# EAGLE design morseovka (EAGLE 9.1.3)
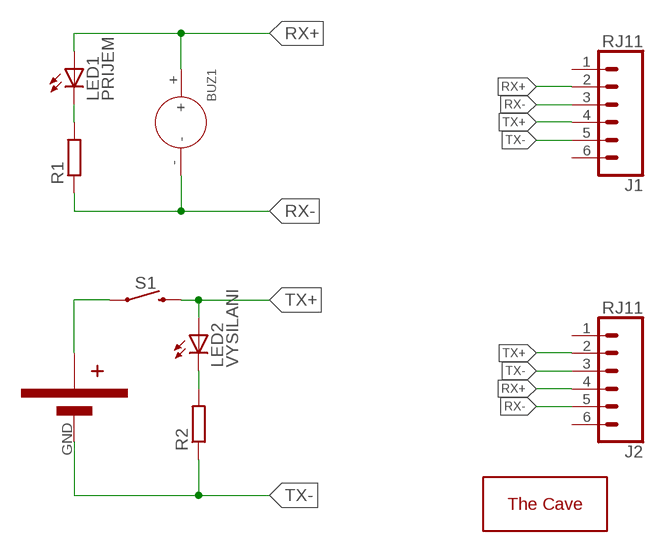
[diagram p0: schematic, sheet 1]

## Parts
BUZ1  DIP-BUZZER-3V(KS-12065D03YA)  [BZ2-7.6-D12.0XH6.5MM]
J1  RJ11  RJ11-6  [RJ11-6]
J2  RJ11  RJ11-6  [RJ11-6]
LED1  PRIJEM  LED5MM  [LED5MM]
LED2  VYSILANI  LED5MM  [LED5MM]
R1  R-EU_0207/7  [0207/7]
R2  R-EU_0207/7  [0207/7]
S1  MOMENTARY-SWITCH-SPST-PTH-12MM  [TACTILE_SWITCH_PTH_12MM]
U$1  CR2032HSMD  [CR2032H]
U$2  THECAVE_LOGO_NEW_TOP  [NEW_LOGO_TOP]

## Nets
N$1: LED1.K(C) R1.2
N$2: S1.1 U$1.VCC.1(VCC) U$1.VCC.2(VCC)
N$4: LED2.K(C) R2.2
RX+: BUZ1.+ J1.2 J2.4 LED1.A
RX-: BUZ1.- J1.3 J2.5 R1.1
TX+: J1.4 J2.2 LED2.A S1.3
TX-: J1.5 J2.3 R2.1 U$1.GND
Unconnected: J1.1 J1.6 J2.1 J2.6

## Library data of the parts
BUZ1 = Seeed-Connector:DIP-BUZZER-3V(KS-12065D03YA): 312010004; MPN: KS-12065D03YA; VALUE: KS-12065D03YA
J1 J2 = SparkFun-Connectors:RJ11-6: RJ11 Jack - 6 pin Commonly found on CAT3 devices and some Microchip programmers. Here is the connector we sell at SparkFun: RJ11 6-Pin Connector <https://www.sparkfun.com/products/132> (PRT-00132) Datasheet <http://www.sparkfun.com/datasheets/Prototyping/Connectors/RJ11-Datasheet.pdf> It is used on this SparkFun product: SparkFun Weather Shield <https://www.sparkfun.com/products/12081> (DEV-12081) Weather Meters <https://www.sparkfun.com/products/8942> (SEN-08942); PROD_ID: CONN-08590; SF_ID: PRT-00132
LED1 LED2 = led:LED: LED OSRAM: - CHIPLED LG R971, LG N971, LY N971, LG Q971, LY Q971, LO R971, LY R971 LH N974, LH R974 LS Q976, LO Q976, LY Q976 LO Q996 - Hyper CHIPLED LW Q18S LB Q993, LB Q99A, LB R99A - SideLED LS A670, LO A670, LY A670, LG A670, LP A670 LB A673, LV A673, LT A673, LW A673 LH A674 LY A675 LS A676, LA A676, LO A676, LY A676, LW A676 LS A679, LY A679, LG A679 - Hyper Micro SIDELED® LS Y876, LA Y876, LO Y876, LY Y876 LT Y87S - SmartLED LW L88C, LW L88S LB L89C, LB L89S, LG L890 LS L89K, LO L89K, LY L89K LS L896, LA L896, LO L896, LY L896 - TOPLED LS T670, LO T670, LY T670, LG T670, LP T670 LSG T670, LSP T670, LSY T670, LOP T670, LYG T670 LG T671, LOG T671, LSG T671 LB T673, LV T673, LT T673, LW T673 LH T674 LS T676, LA T676, LO T676, LY T676, LB T676, LH T676, LSB T676, LW T676 LB T67C, LV T67C, LT T67C, LS T67K, LO T67K, LY T67K, LW E67C LS E67B, LA E67B, LO E67B, LY E67B, LB E67C, LV E67C, LT E67C LW T67C LS T679, LY T679, LG T679 LS T770, LO T770, LY T770, LG T770, LP T770 LB T773, LV T773, LT T773, LW T773 LH T774 LS E675, LA E675, LY E675, LS T675 LS T776, LA T776, LO T776, LY T776, LB T776 LHGB T686 LT T68C, LB T68C - Hyper Mini TOPLED® LB M676 - Mini TOPLED Santana® LG M470 LS M47K, LO M47K, LY M47K Source: http://www.osram.convergy.de LUXEON: - LUMILED® LXK2-PW12-R00, LXK2-PW12-S00, LXK2-PW14-U00, LXK2-PW14-V00 LXK2-PM12-R00, LXK2-PM12-S00, LXK2-PM14-U00 LXK2-PE12-Q00, LXK2-PE12-R00, LXK2-PE12-S00, LXK2-PE14-T00, LXK2-PE14-U00 LXK2-PB12-K00, LXK2-PB12-L00, LXK2-PB12-M00, LXK2-PB14-N00, LXK2-PB14-P00, LXK2-PB14-Q00 LXK2-PR12-L00, LXK2-PR12-M00, LXK2-PR14-Q00, LXK2-PR14-R00 LXK2-PD12-Q00, LXK2-PD12-R00, LXK2-PD12-S00 LXK2-PH12-R00, LXK2-PH12-S00 LXK2-PL12-P00, LXK2-PL12-Q00, LXK2-PL12-R00 Source: www.luxeon.com KINGBRIGHT: KA-3528ASYC Source: www.kingbright.com
R1 R2 = rcl:R-EU_: RESISTOR, European symbol
S1 = SparkFun-Switches:MOMENTARY-SWITCH-SPST: Momentary Switch (Pushbutton) - SPST Normally-open (NO) SPST momentary switches (buttons, pushbuttons). Variants PTH-12MM - 12mm square, through-hole Momentary Pushbutton Switch - 12mm Square <https://www.sparkfun.com/products/9190> (COM-09190) PTH-6.0MM, PTH-6.0MM-KIT - 6.0mm square, through-hole Mini Pushbutton Switch <https://www.sparkfun.com/products/97> (COM-00097) KIT package intended for soldering kit's - only one side of pads' copper is exposed. PTH-RIGHT-ANGLE-KIT - Right-angle, through-hole Right Angle Tactile Button <https://www.sparkfun.com/products/10791> - Used on SparkFun BigTime Watch Kit <https://www.sparkfun.com/products/11734> SMD-12MM - 12mm square, surface-mount Tactile Button - SMD (12mm) <https://www.sparkfun.com/products/12993> (COM-12993) Used on SparkFun PicoBoard <https://www.sparkfun.com/products/11888> SMD-4.5MM - 4.5mm Square Trackball Switch Used on SparkFun Blackberry Trackballer Breakout <https://www.sparkfun.com/products/13169> SMD-4.6MMX2.8MM - 4.60mm x 2.80mm, surface mount Used on SparkFun SAMD21 Mini Breakout <https://www.sparkfun.com/products/13664> SMD-5.2MM, SMD-5.2-REDUNDANT - 5.2mm square, surface-mount Mini Pushbutton Switch - SMD <https://www.sparkfun.com/products/8720> (COM-08720) Used on Arduino Pro Mini <https://www.sparkfun.com/products/11114> REDUNDANT package connects both switch circuits together SMD-6.0X3.5MM - 6.0 x 3.5mm, surface mount Momentary Reset Switch SMD <https://www.sparkfun.com/products/8229> (COM-08229) SMD-6.2MM-TALL - 6.2mm square, surface mount Tactile Button - SMD (6mm) <https://www.sparkfun.com/products/12992> Used on SparkFun Digital Sandbox <https://www.sparkfun.com/products/12651> SMD-RIGHT-ANGLE - Right-angle, surface mount Used on SparkFun Block for Intel® Edison - Arduino <https://www.sparkfun.com/products/13036>; PROD_ID: SWCH-09185; SF_SKU: COM-09190
U$1 = thecave:CR2032H: CR2032 battery holder SMD: https://www.gme.cz/drzak-baterie-do-dps-pro-cr2032-bc-2002 HOLD: https://www.gme.cz/drzak-baterie-do-dps-pro-cr2032-ch25-2032
U$2 = thecave:THECAVE_LOGO: The Cave DIY workshop logos thecave.cz

## Board
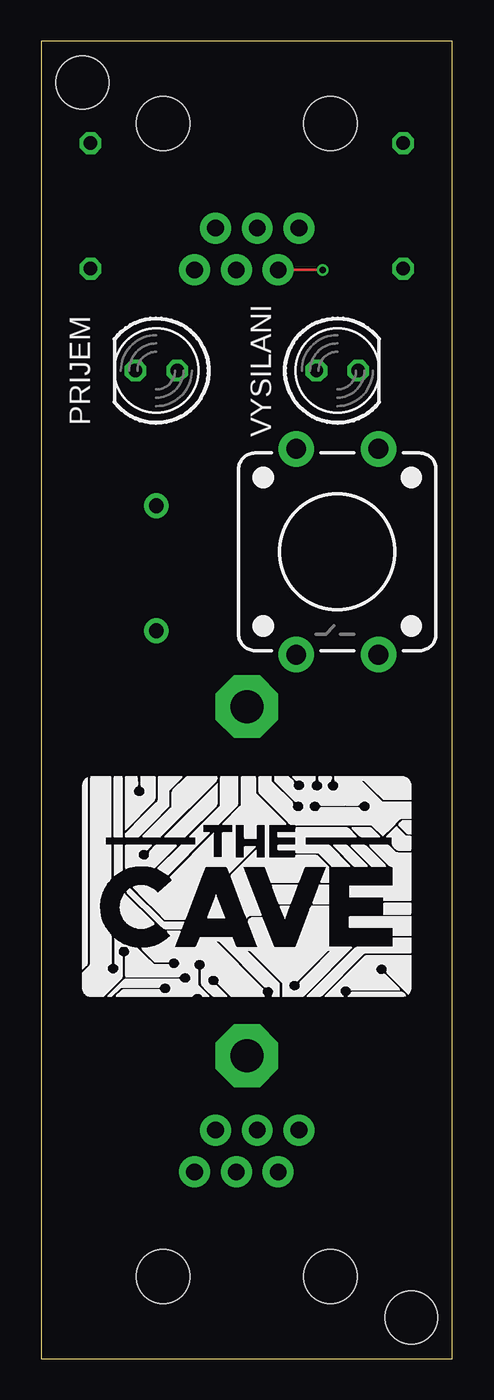
[diagram p1: board, top side]
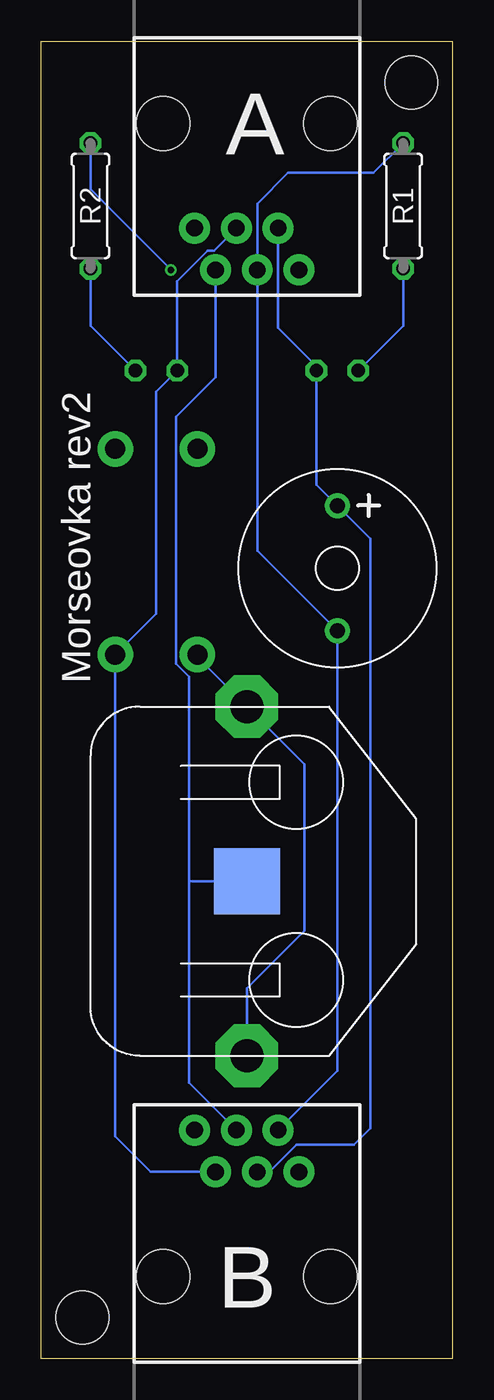
[diagram p2: board, bottom side, seen from below]

Size 25 x 80 mm. Coordinates in mm from the lower left corner, seen from the top.
Outline: 0,80 0,0 25,0 25,80 0,80
Copper layers (1*16): Top 0.035mm / dielectric 1.5mm / Bottom 0.035mm
Design rules "SeeedStudio_2layer_DRU_no_angle_20140221": minimum track width 6mil, minimum drill 12mil, track to track 6mil, track to pad 6mil, pad to pad 6mil, via to via 6mil, smd to smd 0mil, copper to edge 10mil, drill to drill 10mil, minimum pad ring 10mil, minimum via ring 6mil, stop-mask expansion 2mil, vias tented up to drill 100mil, thermal gap 10mil
Holes 3.2 mm at 2.5,77.5 22.5,2.5

### Footprints (pad centres in the part's own frame; a part is rotated, then mirrored left to right if it is on the bottom)
BZ2-7.6-D12.0XH6.5MM = drill 0.9 pad 1.5: + -3.8,0; - 3.8,0
RJ11-6 = drill 1.016 pad 1.88: 1 -3.175,8.89; 2 -1.905,6.35; 3 -0.635,8.89; 4 0.635,6.35; 5 1.905,8.89; 6 3.175,6.35 | hole 3.251: -5.08,0; 5.08,0
LED5MM = drill 0.813 octagon: A -1.27,0; K 1.27,0
0207/7 = drill 0.813 octagon: 1 -3.81,0; 2 3.81,0
TACTILE_SWITCH_PTH_12MM = drill 1.2 pad 2.159: 1 6.25,-2.5; 2 -6.25,-2.5; 3 6.25,2.5; 4 -6.25,2.5
CR2032H = smd 4 x 4: GND 0,0 | drill 2 pad 3.81 octagon: VCC.1 -10.6,0; VCC.2 10.6,0

### Placement (x,y rotation side)
BUZ1  7,48 270 bottom
J1  12.5,75 180 bottom
J2  12.5,5 0 bottom
LED1  7,60 180 top
LED2  18,60 0 top
R1  3,70 270 bottom
R2  22,70 270 bottom
S1  18,49 270 top
U$1  12.5,29 90 bottom
U$2  2.5,22 0 top

### Tracks (layer width: path | path; a pad name or v marks a point on that pad's centre or on a via)
N$1
  Bottom 0.152: R1.2 3,62.73 LED1.K
N$2
  Bottom 0.152: S1.1 15.5,42.6 U$1.VCC.2 9,36.1 9,26 12.5,22.5 U$1.VCC.1
N$4
  Bottom 0.152: LED2.K 22,62.73 R2.2
RX+
  Bottom 0.152: J1.2 10.6,62.59 8.27,60.27 LED1.A 8.27,53.07 BUZ1.+ 5,49.8 5,14 6,13 9.49,13 11.14,11.35 J2.4
RX-
  Bottom 0.152: J2.5 7,17.48 BUZ1.- 11.87,49.06 J1.3 11.87,70.14 10,72 4.81,72 R1.1
TX+
  Bottom 0.152: J2.2 18.35,11.35 20.5,13.5 S1.3 18,45.25 18,58.73 LED2.A 16.73,65.44 14.89,67.28 14.51,67.28 J1.4
TX-  (via drill 0.4)
  Top 0.152: v17.11,66.11 J1.5
  Bottom 0.152: J2.3 16,16.75 16,29 | 16,29 U$1.GND | 16,29 16,41.4 16.81,42.21 16.81,57.19 14.4,59.59 J1.5 | R2.1 22,71 v17.11,66.11

### Text on the board
bPlace: A | Morseovka rev2 | B